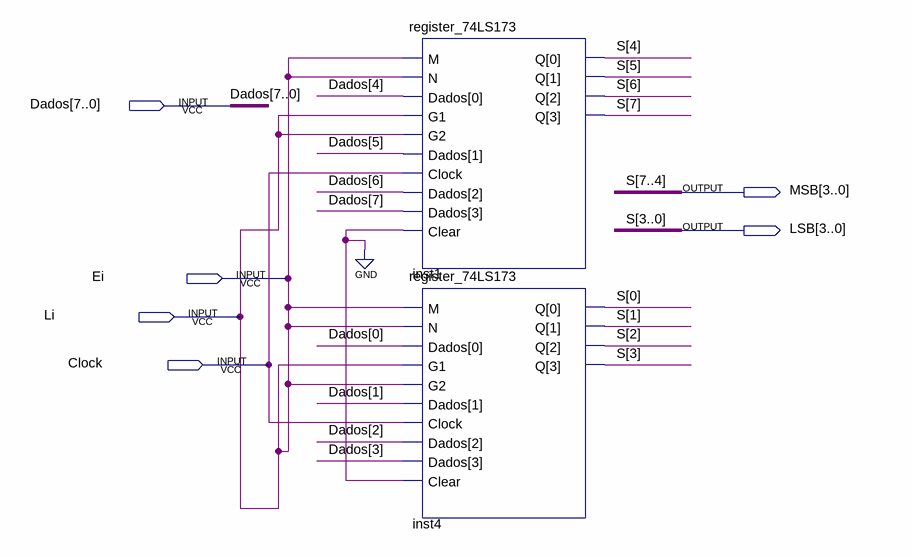
[diagram p0: schematic sheet]
// Quartus schematic register_of_inscructions.bdf as structural Verilog: 2 symbols, 6 pins
module register_of_inscructions (
  input  [7:0] Dados,
  input  Ei,
  input  Li,
  input  Clock,
  output [3:0] MSB,
  output [3:0] LSB
);

  register_74LS173 inst1 (.M(Ei), .N(Ei), .Dados(Dados[7:4]), .G1(Ei), .G2(Ei), .Clock(Clock), .Clear(1'b0), .Q(MSB));
  register_74LS173 inst4 (.M(Ei), .N(Ei), .Dados(Dados[3:0]), .G1(Ei), .G2(Ei), .Clock(Clock), .Clear(1'b0), .Q(LSB));

  assign Li = Ei;

  // Other names for the same wires on the sheet: S[7:0] = {MSB, LSB}
endmodule
